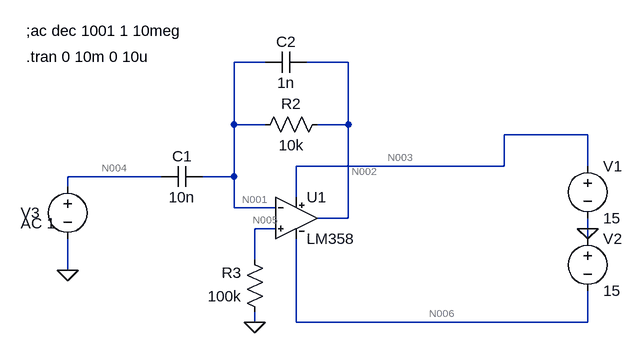
[diagram p0: schematic Derivador.asc]
Derivador.asc, the LTspice schematic file:
Version 4
SHEET 1 880 680
WIRE 272 -128 224 -128
WIRE 400 -128 336 -128
WIRE 224 -32 224 -128
WIRE 272 -32 224 -32
WIRE 400 -32 400 -128
WIRE 400 -32 352 -32
WIRE 768 -16 640 -16
WIRE 640 32 640 -16
WIRE 640 32 320 32
WIRE 768 32 768 -16
WIRE 112 48 -32 48
WIRE 224 48 224 -32
WIRE 224 48 176 48
WIRE -32 64 -32 48
WIRE 320 80 320 32
WIRE 224 96 224 48
WIRE 288 96 224 96
WIRE 400 112 400 -32
WIRE 400 112 352 112
WIRE 288 128 256 128
WIRE 768 128 768 112
WIRE 768 144 768 128
WIRE 256 176 256 128
WIRE -32 192 -32 144
WIRE 256 272 256 256
WIRE 320 272 320 144
WIRE 768 272 768 224
WIRE 768 272 320 272
FLAG -32 192 0
FLAG 256 272 0
FLAG 768 128 0
SYMBOL res 272 272 R180
WINDOW 0 36 76 Left 2
WINDOW 3 36 40 Left 2
SYMATTR InstName R3
SYMATTR Value 100k
SYMBOL voltage 768 16 R0
WINDOW 123 0 0 Left 2
WINDOW 39 0 0 Left 2
SYMATTR InstName V1
SYMATTR Value 15
SYMBOL voltage 768 128 R0
WINDOW 123 0 0 Left 2
WINDOW 39 0 0 Left 2
SYMATTR InstName V2
SYMATTR Value 15
SYMBOL voltage -32 48 R0
WINDOW 0 -72 56 Left 2
WINDOW 3 -301 -26 Invisible 2
WINDOW 123 -72 72 Left 2
WINDOW 39 0 0 Left 2
SYMATTR InstName V3
SYMATTR Value PWL(0 -10 0.5m 10 1m -10 1.5m 10 2m -10 2.5m 10)
SYMATTR Value2 AC 1
SYMBOL res 368 -48 R90
WINDOW 0 0 56 VBottom 2
WINDOW 3 32 56 VTop 2
SYMATTR InstName R2
SYMATTR Value 10k
SYMBOL cap 176 32 R90
WINDOW 0 0 32 VBottom 2
WINDOW 3 32 32 VTop 2
SYMATTR InstName C1
SYMATTR Value 10n
SYMBOL cap 336 -144 R90
WINDOW 0 0 32 VBottom 2
WINDOW 3 32 32 VTop 2
SYMATTR InstName C2
SYMATTR Value 1n
SYMBOL AutoGenerated\\LM358 320 48 R0
SYMATTR InstName U1
TEXT -96 -136 Left 2 !.tran 0 10m 0 10u
TEXT -96 -176 Left 2 !;ac dec 1001 1 10meg

The netlist it stands for:
* Derivador.asc
R3 0 N005 100k
V1 N003 0 15
V2 0 N006 15
V3 N004 0 PWL(0 -10 0.5m 10 1m -10 1.5m 10 2m -10 2.5m 10) AC 1
R2 N002 N001 10k
C1 N001 N004 10n
C2 N002 N001 1n
XU1 N005 N001 N003 N006 N002 LM358  ; pins In+ In- V+ V- OUT
.tran 0 10m 0 10u
;ac dec 1001 1 10meg
.lib LM358.lib
.backanno
.end

* Results of the author's LTspice run, read from the files saved beside the schematic
* Operating Point, zero values left out:
*   V(n005) = 1.992 mV
*   V(n003) = 15 V
*   V(n006) = -15 V
*   V(n004) = -10 V
*   V(n002) = 1.759 mV
*   V(n001) = 1.958 mV
*   I(R2) = -19.93 nA
*   I(R3) = -19.92 nA
*   I(V2) = -999.7 µA
*   I(V1) = -999.8 µA
*   Ix(u1:1) = -19.92 nA
*   Ix(u1:2) = -19.93 nA
*   Ix(u1:3) = 999.8 µA
*   Ix(u1:4) = -999.7 µA
*   Ix(u1:5) = 19.93 nA
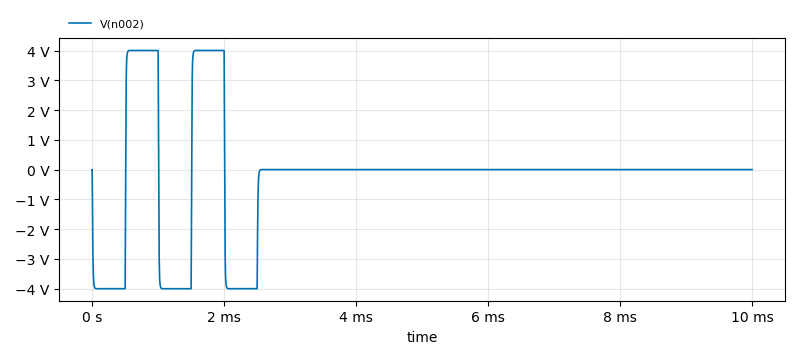
[diagram p1: Transient Analysis of Derivador.asc, plotted from the saved traces]
* Transient Analysis, 1 run:
*   V(n002): min -4.001 V, max 4.005 V, average -198.2 mV, rms 1.973 V, last 1.759 mV